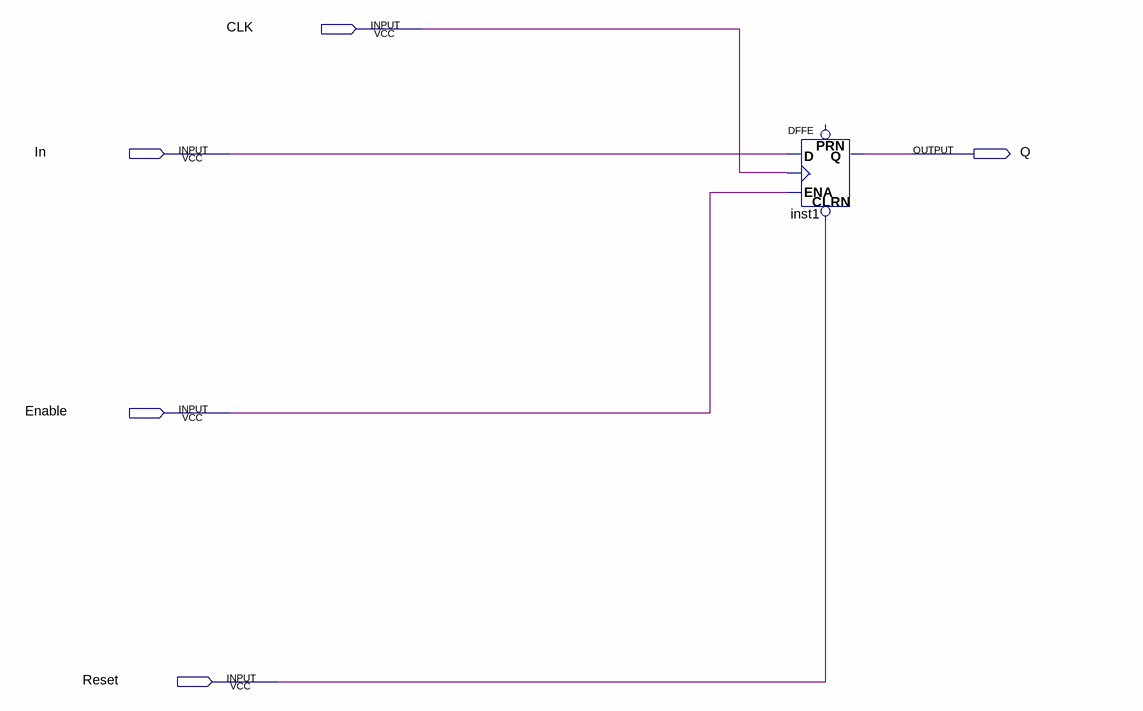
[diagram p0: schematic sheet]
// Quartus schematic PC.bdf as structural Verilog: 1 symbols, 5 pins
module PC (
  input  CLK,
  input  In,
  input  Enable,
  input  Reset,
  output Q
);

  DFFE inst1 (.CLRN(Reset), .D(In), .CLK(CLK), .ENA(Enable), .Q(Q));  // open: PRN
endmodule
